# EAGLE schematic impulse (EAGLE 6.5.0)
AUTHOR: Brad Campbell; REV: A; TITLE: Impulse

## Sheet 1 of 2
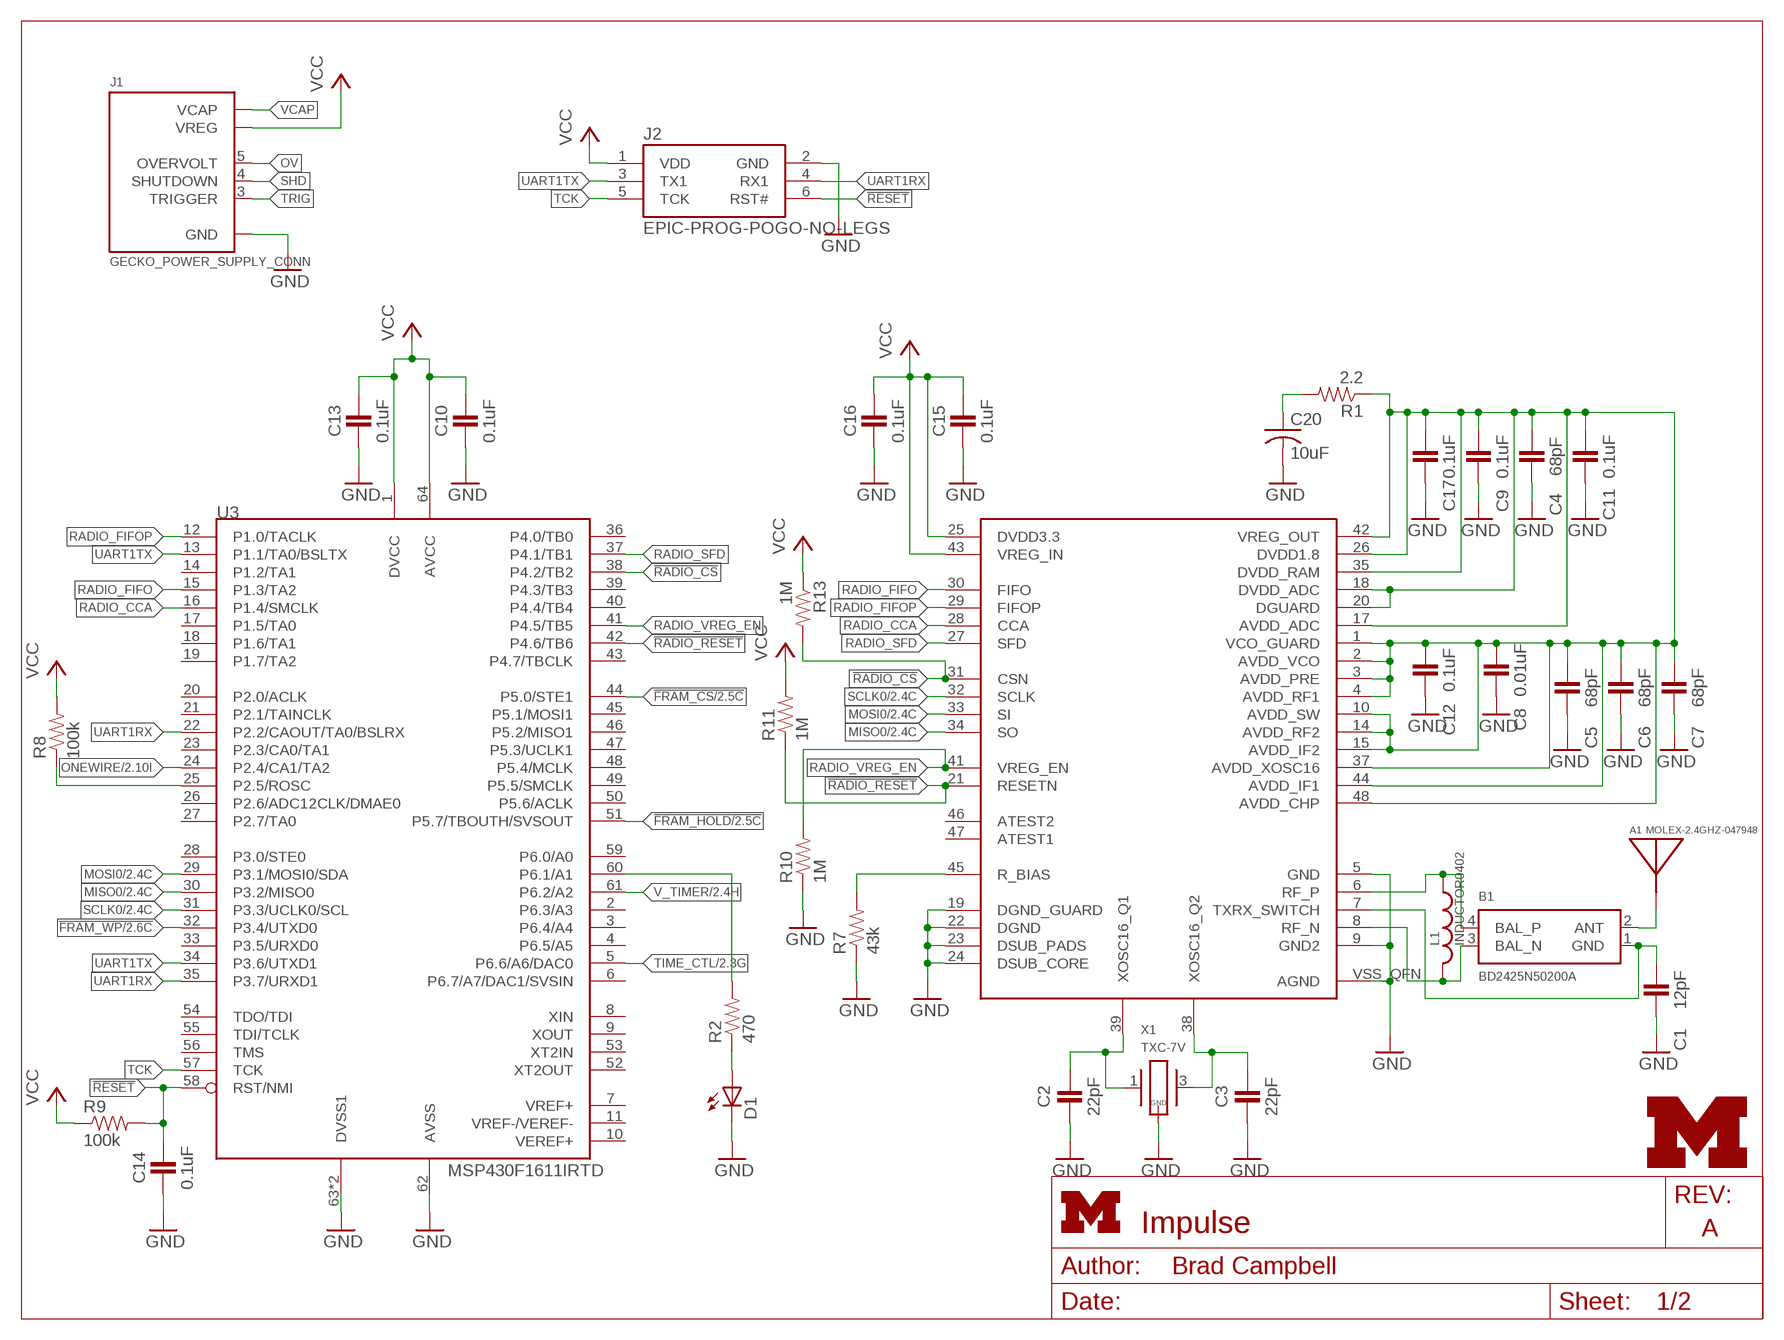
[diagram p0: schematic, sheet 1]
FRAME1 (LETTER_L): HEIGHT: 8.5in; WIDTH: 11in

### Parts
A1  MOLEX-2.4GHZ-047948  [MOLEX-47948-ANTENNA]
B1  BD2425N50200A  [BD2425N50200A]
C1  12pF  CAPACITOR  [0402_CAP]
C2  22pF  CAPACITOR  [0402_CAP]
C3  22pF  CAPACITOR  [0402_CAP]
C4  68pF  CAPACITOR  [0402_CAP]
C5  68pF  CAPACITOR  [0402_CAP]
C6  68pF  CAPACITOR  [0402_CAP]
C7  68pF  CAPACITOR  [0402_CAP]
C8  0.01uF  CAPACITOR  [0402_CAP]
C9  0.1uF  CAPACITOR  [0402_CAP]
C10  0.1uF  CAPACITOR  [0402_CAP]
C11  0.1uF  CAPACITOR  [0402_CAP]
C12  0.1uF  CAPACITOR  [0402_CAP]
C13  0.1uF  CAPACITOR  [0402_CAP]
C14  0.1uF  CAPACITOR  [0402_CAP]
C15  0.1uF  CAPACITOR  [0402_CAP]
C16  0.1uF  CAPACITOR  [0402_CAP]
C17  0.1uF  CAPACITOR  [0402_CAP]
C20  10uF  C-USC0805  [C0805]
D1  LED0603  [LED-0603]
J1  GECKO_POWER_SUPPLY_CONN  [HEADER1X6/0.05IN]
J2  EPIC-PROG-POGO-NO-LEGS  [TC2030-IDC-NL]
L1  INDUCTOR0402  [0402_CAP]
R1  2.2  RESISTOR  [0402_RES]
R2  470  RESISTOR  [0402_RES]
R7  43k  RESISTOR  [0402_RES]
R8  100k  RESISTOR  [0402_RES]
R9  100k  RESISTOR  [0402_RES]
R10  1M  RESISTOR  [0402_RES]
R11  1M  RESISTOR  [0402_RES]
R13  1M  RESISTOR  [0402_RES]
U3  MSP430F1611IRTD  [S-PVQFN-N64]
U4  CC2420RGZ  [S-PVQFN-N48]
U$1  UMICH_SOLID_SMALL  [UMICH_SOLID_75MIL]
X1  TXC-7V  [TXC-7V]

### Nets
!FRAM_CS: U3.44(P5.0/STE1) ; also sheet 2
!FRAM_HOLD: U3.51(P5.7/TBOUTH/SVSOUT) ; also sheet 2
!FRAM_WP: U3.32(P3.4/UTXD0) ; also sheet 2
!RADIO_CS: R13.2 U3.38(P4.2/TB2) U4.31(CSN)
!RADIO_RESET: R11.1 U3.42(P4.6/TB6) U4.21(RESETN)
!RESET: C14.1 J2.6(RST#) R9.2 U3.58(RST/NMI)
GND: C1.2 C2.2 C3.2 C4.2 C5.2 C6.2 C7.2 C8.2 C9.2 C10.2 C11.2 C12.2 C13.2 C14.2 C15.2 C16.2 C17.2 C20.2 D1.C J1.1(GND) J2.2(GND) R7.1 R10.1 U3.62(AVSS) U3.63(DVSS1) U3.GND(DVSS1) U4.5(GND) U4.9(GND2) U4.19(DGND_GUARD) U4.22(DGND) U4.23(DSUB_PADS) U4.24(DSUB_CORE) U4.VSS_QFN(AGND) X1.2(GND) X1.4(GND) ; also sheet 2
MISO0: U3.30(P3.2/MISO0) U4.34(SO) ; also sheet 2
MOSI0: U3.29(P3.1/MOSI0/SDA) U4.33(SI) ; also sheet 2
N$1: R8.1 U3.25(P2.5/ROSC)
N$5: R7.2 U4.45(R_BIAS)
N$6: D1.A R2.1
N$7: C20.1 R1.2
N$8: C4.1 C5.1 C6.1 C7.1 C8.1 C9.1 C11.1 C12.1 C17.1 R1.1 U4.1(VCO_GUARD) U4.2(AVDD_VCO) U4.3(AVDD_PRE) U4.4(AVDD_RF1) U4.10(AVDD_SW) U4.14(AVDD_RF2) U4.15(AVDD_IF2) U4.17(AVDD_ADC) U4.18(DVDD_ADC) U4.20(DGUARD) U4.26(DVDD1.8) U4.35(DVDD_RAM) U4.37(AVDD_XOSC16) U4.42(VREG_OUT) U4.44(AVDD_IF1) U4.48(AVDD_CHP)
N$10: R2.2 U3.60(P6.1/A1)
N$12: B1.1(GND) C1.1 U4.7(TXRX_SWITCH)
N$17: B1.3(BAL_N) L1.2 U4.8(RF_N)
N$18: B1.4(BAL_P) L1.1 U4.6(RF_P)
N$19: C3.1 U4.38(XOSC16_Q2) X1.3
N$20: C2.1 U4.39(XOSC16_Q1) X1.1
ONEWIRE: U3.24(P2.4/CA1/TA2) ; also sheet 2
OV: J1.5(OVERVOLT)
RADIO_CCA: U3.16(P1.4/SMCLK) U4.28(CCA)
RADIO_FIFO: U3.15(P1.3/TA2) U4.30(FIFO)
RADIO_FIFOP: U3.12(P1.0/TACLK) U4.29(FIFOP)
RADIO_SFD: U3.37(P4.1/TB1) U4.27(SFD)
RADIO_VREG_EN: R10.2 U3.41(P4.5/TB5) U4.41(VREG_EN)
SCLK0: U3.31(P3.3/UCLK0/SCL) U4.32(SCLK) ; also sheet 2
SHD: J1.4(SHUTDOWN)
TCK: J2.5(TCK) U3.57(TCK)
TIME_CTL: U3.5(P6.6/A6/DAC0) ; also sheet 2
TRIG: J1.3(TRIGGER)
UART1RX: J2.4(RX1) U3.22(P2.2/CAOUT/TA0/BSLRX) U3.35(P3.7/URXD1)
UART1TX: J2.3(TX1) U3.13(P1.1/TA0/BSLTX) U3.34(P3.6/UTXD1)
UNBAL: A1.1(ANTENNA) B1.2(ANT)
V_TIMER: U3.61(P6.2/A2) ; also sheet 2
VCAP: J1.6(VCAP)
VCC: C10.1 C13.1 C15.1 C16.1 J1.2(VREG) J2.1(VDD) R8.2 R9.1 R11.2 R13.1 U3.1(DVCC) U3.64(AVCC) U4.25(DVDD3.3) U4.43(VREG_IN) ; also sheet 2
Unconnected: U3.2(P6.3/A3) U3.3(P6.4/A4) U3.4(P6.5/A5) U3.6(P6.7/A7/DAC1/SVSIN) U3.7(VREF+) U3.8(XIN) U3.9(XOUT) U3.10(VEREF+) U3.11(VREF-/VEREF-) U3.14(P1.2/TA1) U3.17(P1.5/TA0) U3.18(P1.6/TA1) U3.19(P1.7/TA2) U3.20(P2.0/ACLK) U3.21(P2.1/TAINCLK) U3.23(P2.3/CA0/TA1) U3.26(P2.6/ADC12CLK/DMAE0) U3.27(P2.7/TA0) U3.28(P3.0/STE0) U3.33(P3.5/URXD0) U3.36(P4.0/TB0) U3.39(P4.3/TB3) U3.40(P4.4/TB4) U3.43(P4.7/TBCLK) U3.45(P5.1/MOSI1) U3.46(P5.2/MISO1) U3.47(P5.3/UCLK1) U3.48(P5.4/MCLK) U3.49(P5.5/SMCLK) U3.50(P5.6/ACLK) U3.52(XT2OUT) U3.53(XT2IN) U3.54(TDO/TDI) U3.55(TDI/TCLK) U3.56(TMS) U3.59(P6.0/A0) U4.46(ATEST2) U4.47(ATEST1)

## Sheet 2 of 2
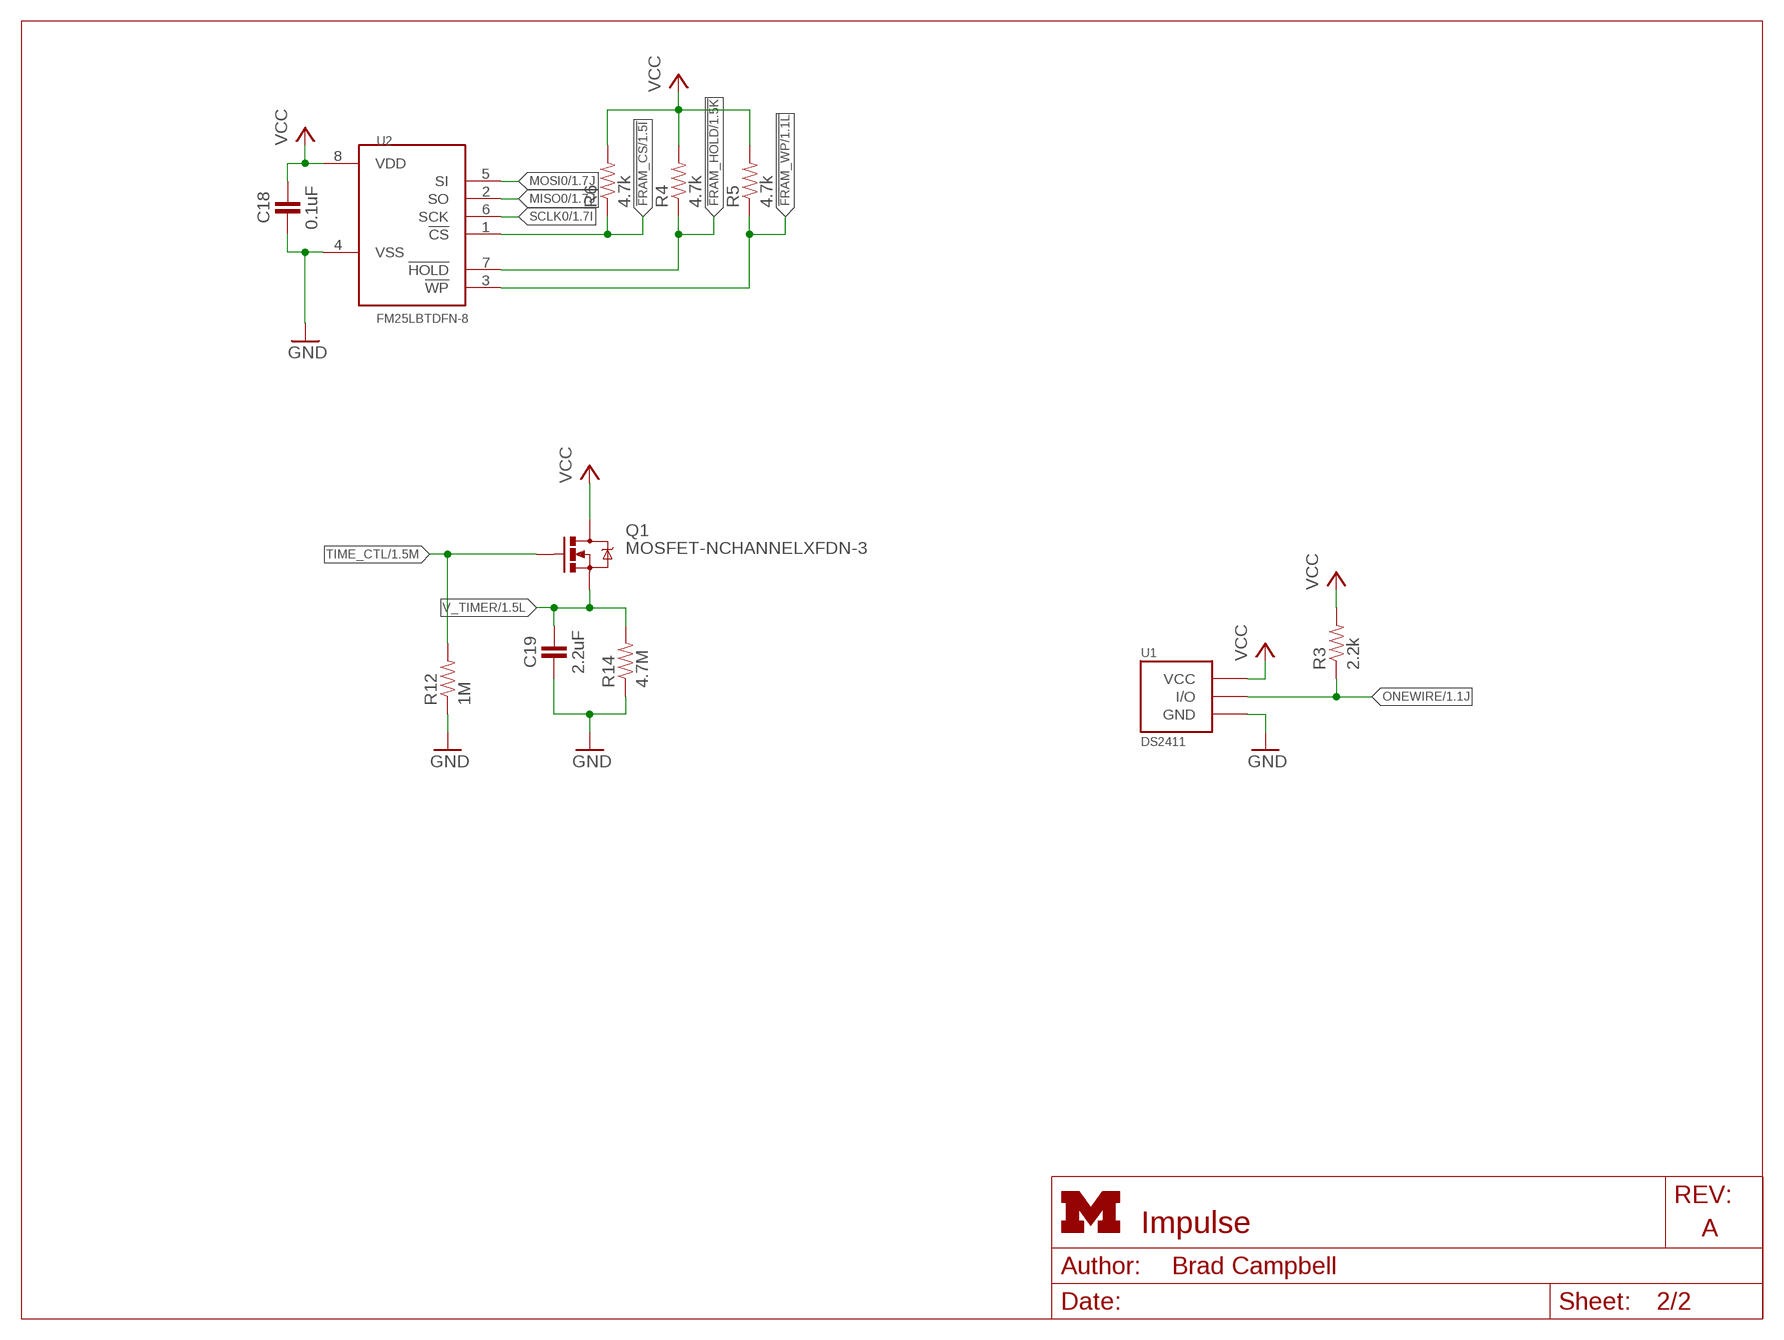
[diagram p1: schematic, sheet 2]
FRAME2 (LETTER_L): HEIGHT: 8.5in; WIDTH: 11in

### Parts
C18  0.1uF  CAPACITOR  [0402_CAP]
C19  2.2uF  CAPACITOR  [0402_CAP]
Q1  MOSFET-NCHANNELXFDN-3  [XFDFN-3]
R3  2.2k  RESISTOR  [0402_RES]
R4  4.7k  RESISTOR  [0402_RES]
R5  4.7k  RESISTOR  [0402_RES]
R6  4.7k  RESISTOR  [0402_RES]
R12  1M  RESISTOR  [0402_RES]
R14  4.7M  RESISTOR  [0402_RES]
U1  DS2411  [SOT-23]
U2  FM25LBTDFN-8  [TDFN-8]

### Nets
!FRAM_CS: R6.1 U2.1(!CS) ; also sheet 1
!FRAM_HOLD: R4.1 U2.7(!HOLD) ; also sheet 1
!FRAM_WP: R5.1 U2.3(!WP) ; also sheet 1
GND: C18.2 C19.2 R12.1 R14.1 U1.3(GND) U2.4(VSS) ; also sheet 1
MISO0: U2.2(SO) ; also sheet 1
MOSI0: U2.5(SI) ; also sheet 1
ONEWIRE: R3.1 U1.1(I/O) ; also sheet 1
SCLK0: U2.6(SCK) ; also sheet 1
TIME_CTL: Q1.G R12.2 ; also sheet 1
V_TIMER: C19.1 Q1.S R14.2 ; also sheet 1
VCC: C18.1 Q1.D R3.2 R4.2 R5.2 R6.2 U1.2(VCC) U2.8(VDD) ; also sheet 1

## Library data of the parts
A1 = chips:MOLEX-2.4GHZ-047948; DIGIKEY: WM4893CT-ND
B1 = chips:BD2425N50200A; DIGIKEY: 1173-1063-1-ND
C1-C19 = passives:CAPACITOR: 0402 Capacitor
C20 = rcl:C-US: CAPACITOR, American symbol; DIGIKEY: 478-2561-1-ND
D1 = SparkFun-LED:LED: LEDs Standard schematic elements and footprints for 5mm, 3mm, 1206, and 0603 sized LEDs. 5mm - Spark Fun Electronics SKU : COM-00529 (and others)
J1 = gecko:GECKO_POWER_SUPPLY_CONN: Header on the gecko power supply board.
J2 = epic:EPIC-PROG-POGO: Epic programmer based on the Tag Connect pogo pin cable.; TAG-CONNECT: TC2030-IDC-NL
L1 = passives:INDUCTOR; DIGIKEY: 712-1419-1-ND
Q1 = fets:MOSFET-NCHANNEL: Generic NMOS footprint; DIGIKEY: DMN2400UFB4-7DICT-ND
R1-R14 = passives:RESISTOR: Resistor Basic schematic elements and footprints for 0603, 1206, and PTH resistors.
U1 = chips:DS2411: Maxim DS2411 Silicon Serial Number with VCC Input; DIGIKEY: DS2411R+CT-ND
U2 = chips:FM25LB: IC FRAM 4KBIT 10MHZ 8SOIC; DIGIKEY: FM25L04B-DGRA-ND; MOUSER: 877-FM25L04B-DG
U3 = chips:MSP430F1611; DIGIKEY: 296-18102-1-ND
U4 = chips:CC2420: 2.4 GHz IEEE 802.15.4 / ZigBee-ready RF Transceiver; DIGIKEY: 296-19585-1-ND
U$1 = logos:UMICH_SOLID
X1 = crystals:TXC-7V